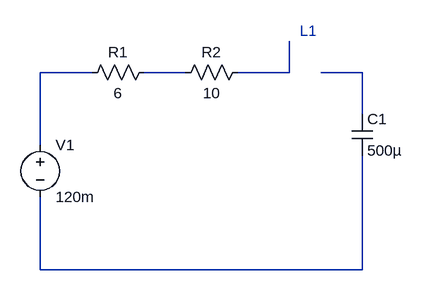
[diagram p0: schematic EJ2_teoría_eq.asc]
EJ2_teoría_eq.asc, the LTspice schematic file:
Version 4.1
SHEET 1 920 680
WIRE 256 -80 176 -80
WIRE 400 -80 336 -80
WIRE 560 -80 560 -128
WIRE 560 -80 480 -80
WIRE 672 -80 608 -80
WIRE 672 -16 672 -80
WIRE 176 32 176 -80
WIRE 176 224 176 112
WIRE 672 224 672 48
WIRE 672 224 176 224
SYMBOL res 496 -96 R90
WINDOW 0 0 56 VBottom 2
WINDOW 3 32 56 VTop 2
SYMATTR InstName R2
SYMATTR Value 10
SYMBOL cap 656 -16 R0
SYMATTR InstName C1
SYMATTR Value 500µ
SYMBOL voltage 176 16 R0
SYMATTR InstName V1
SYMATTR Value 120m
SYMBOL res 352 -96 R90
WINDOW 0 0 56 VBottom 2
WINDOW 3 32 56 VTop 2
SYMATTR InstName R1
SYMATTR Value 6
TEXT 576 -144 Left 2 ;L1

The netlist it stands for:
* EJ2_teoría_eq.asc
R2 N003 N002 10
C1 N004 N005 500µ
V1 N001 N005 120m
R1 N002 N001 6
* L1
.backanno
.end